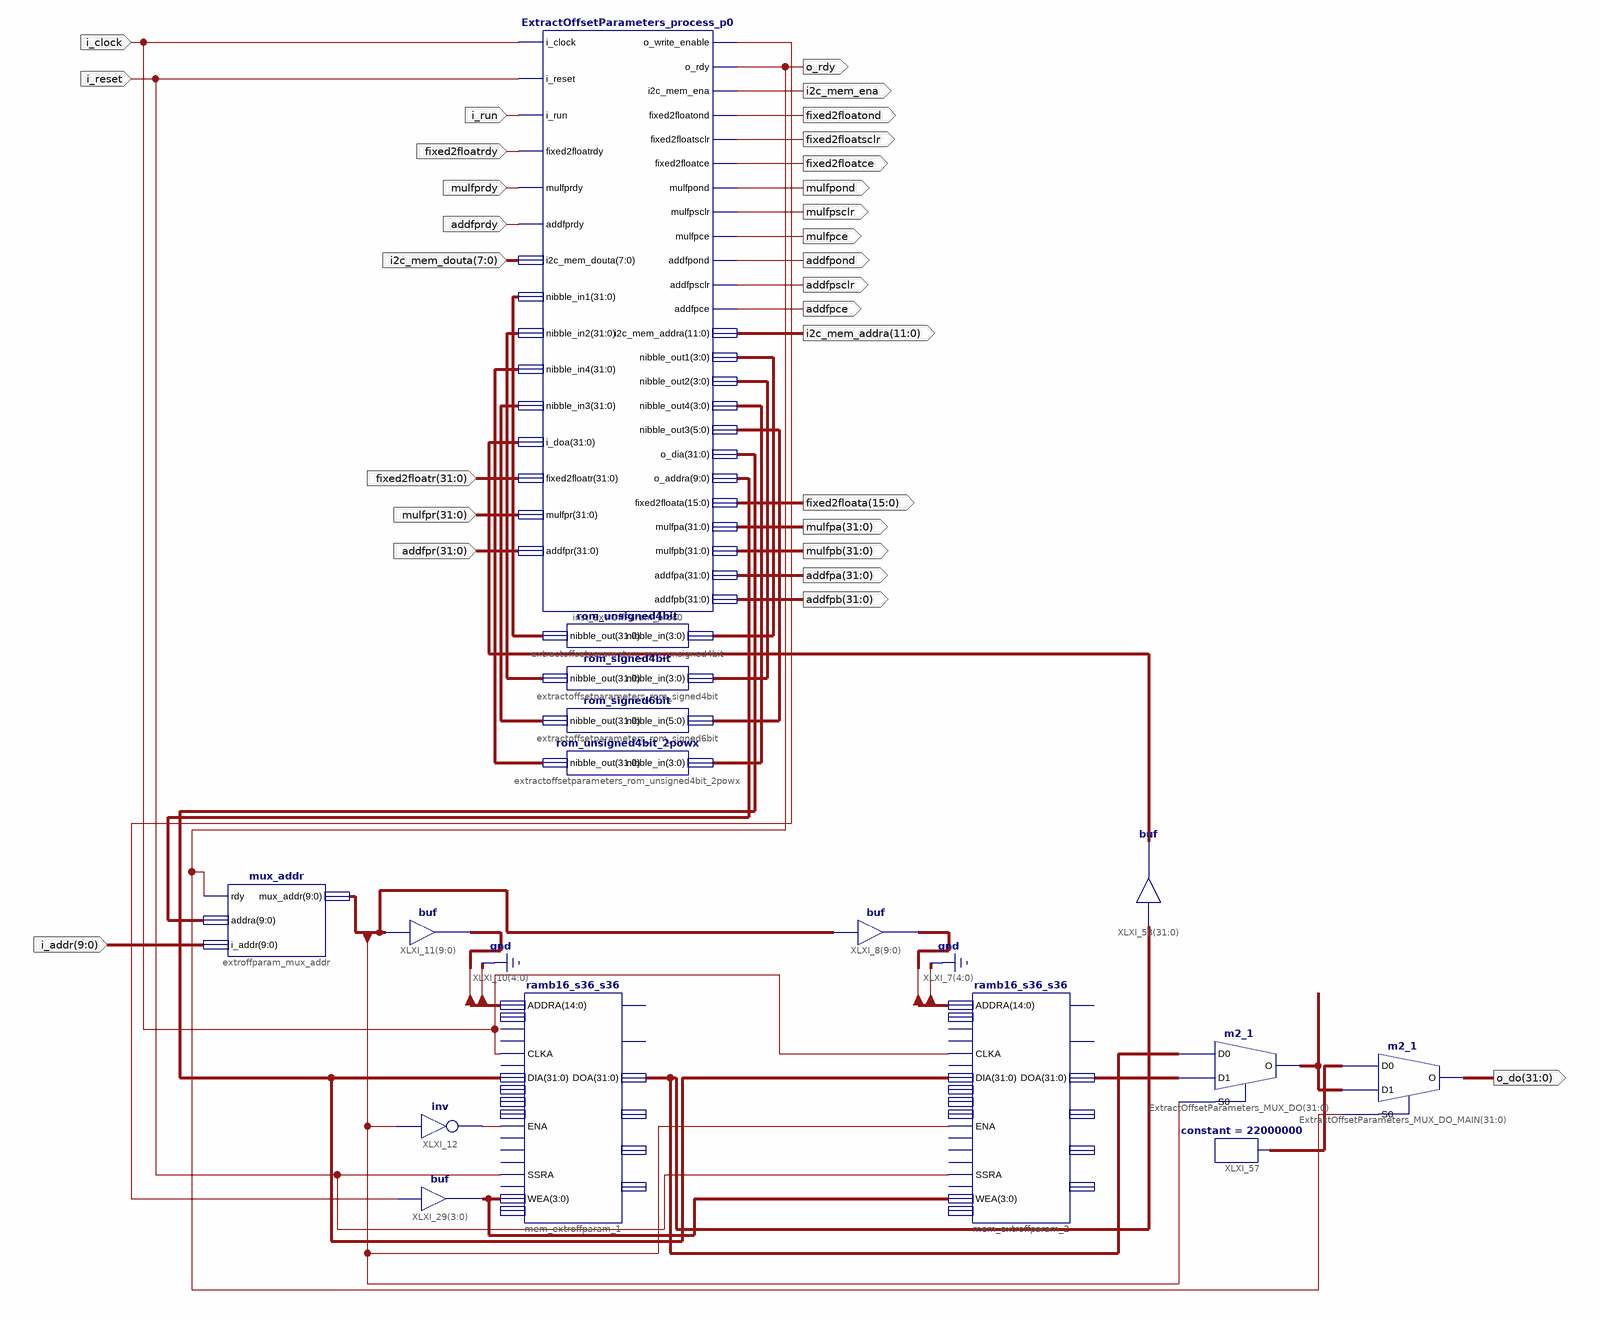
[diagram p0: schematic sheet 1]
// Xilinx ISE schematic ExtractOffsetParameters.sch (virtex4) as structural Verilog: 16 symbols, 29 ports
module ExtractOffsetParameters (
  input  i_clock,
  input  i_reset,
  input  [9:0] i_addr,
  input  i_run,
  input  fixed2floatrdy,
  input  mulfprdy,
  input  addfprdy,
  input  [7:0] i2c_mem_douta,
  input  [31:0] fixed2floatr,
  input  [31:0] mulfpr,
  input  [31:0] addfpr,
  output o_rdy,
  output i2c_mem_ena,
  output fixed2floatond,
  output fixed2floatsclr,
  output fixed2floatce,
  output mulfpond,
  output mulfpsclr,
  output mulfpce,
  output addfpond,
  output addfpsclr,
  output addfpce,
  output [11:0] i2c_mem_addra,
  output [15:0] fixed2floata,
  output [31:0] mulfpa,
  output [31:0] mulfpb,
  output [31:0] addfpa,
  output [31:0] addfpb,
  output [31:0] o_do
);

  wire write_enable, XLXN_59;
  wire [3:0] nibble_out1, nibble_out2, nibble_out4, XLXN_139;
  wire [5:0] nibble_out3;
  wire [9:0] mux_addr1, o_addra;
  wire [14:5] addra1, addra2;
  wire [31:0] doa1, doa2, nibble_in1, nibble_in2, nibble_in3, nibble_in4, o_dia, XLXN_169, XLXN_179, XLXN_180;

  assign addra2 = mux_addr1;  // buf XLXI_8[9..0], 10 bits wide
  assign addra1 = mux_addr1;  // buf XLXI_11[9..0], 10 bits wide
  not XLXI_12 (XLXN_59, mux_addr1[9]);
  ramb16_s36_s36 #(.WRITE_WIDTH_B(36), .WRITE_WIDTH_A(36), .WRITE_MODE_B("READ_FIRST"), .WRITE_MODE_A("READ_FIRST"), .READ_WIDTH_B(36), .READ_WIDTH_A(36)) mem_extroffparam_2 (
    .ADDRA({addra2, {5{1'b0}}}), .CLKA(i_clock), .DIA(o_dia), .ENA(mux_addr1[9]), .SSRA(i_reset),
    .WEA(XLXN_139), .DOA(doa2));  // open: ADDRB, CASCADEINA, CASCADEINB, CLKB, DIB, DIPA, DIPB, REGCEA, REGCEB, ENB, SSRB, WEB, CASCADEOUTA, CASCADEOUTB, DOB, DOPA, DOPB
  ramb16_s36_s36 #(.WRITE_WIDTH_B(36), .WRITE_WIDTH_A(36), .WRITE_MODE_B("READ_FIRST"), .WRITE_MODE_A("READ_FIRST"), .READ_WIDTH_B(36), .READ_WIDTH_A(36)) mem_extroffparam_1 (
    .ADDRA({addra1, {5{1'b0}}}), .CLKA(i_clock), .DIA(o_dia), .ENA(XLXN_59), .SSRA(i_reset), .WEA(XLXN_139),
    .DOA(doa1));  // open: ADDRB, CASCADEINA, CASCADEINB, CLKB, DIB, DIPA, DIPB, REGCEA, REGCEB, ENB, SSRB, WEB, CASCADEOUTA, CASCADEOUTB, DOB, DOPA, DOPB
  m2_1 ExtractOffsetParameters_MUX_DO[31:0] (.D0(doa1), .D1(doa2), .S0(mux_addr1[9]), .O(XLXN_180));
  assign XLXN_139 = {4{write_enable}};  // buf XLXI_29[3..0], 4 bits wide
  ExtractOffsetParameters_process_p0 inst_ExtrOffParam_proc0 (
    .i_clock(i_clock), .i_reset(i_reset), .i_run(i_run), .fixed2floatrdy(fixed2floatrdy),
    .mulfprdy(mulfprdy), .addfprdy(addfprdy), .i2c_mem_douta(i2c_mem_douta), .nibble_in1(nibble_in1),
    .nibble_in2(nibble_in2), .nibble_in4(nibble_in4), .nibble_in3(nibble_in3), .i_doa(XLXN_169),
    .fixed2floatr(fixed2floatr), .mulfpr(mulfpr), .addfpr(addfpr), .o_write_enable(write_enable),
    .o_rdy(o_rdy), .i2c_mem_ena(i2c_mem_ena), .fixed2floatond(fixed2floatond),
    .fixed2floatsclr(fixed2floatsclr), .fixed2floatce(fixed2floatce), .mulfpond(mulfpond),
    .mulfpsclr(mulfpsclr), .mulfpce(mulfpce), .addfpond(addfpond), .addfpsclr(addfpsclr), .addfpce(addfpce),
    .i2c_mem_addra(i2c_mem_addra), .nibble_out1(nibble_out1), .nibble_out2(nibble_out2),
    .nibble_out4(nibble_out4), .nibble_out3(nibble_out3), .o_dia(o_dia), .o_addra(o_addra),
    .fixed2floata(fixed2floata), .mulfpa(mulfpa), .mulfpb(mulfpb), .addfpa(addfpa), .addfpb(addfpb));
  rom_unsigned4bit extractoffsetparameters_rom_unsigned4bit (.nibble_in(nibble_out1), .nibble_out(nibble_in1));
  rom_signed4bit extractoffsetparameters_rom_signed4bit (.nibble_in(nibble_out2), .nibble_out(nibble_in2));
  rom_signed6bit extractoffsetparameters_rom_signed6bit (.nibble_in(nibble_out3), .nibble_out(nibble_in3));
  rom_unsigned4bit_2powx extractoffsetparameters_rom_unsigned4bit_2powx (
    .nibble_in(nibble_out4), .nibble_out(nibble_in4));
  mux_addr extroffparam_mux_addr (.rdy(o_rdy), .addra(o_addra), .i_addr(i_addr), .mux_addr(mux_addr1));
  m2_1 ExtractOffsetParameters_MUX_DO_MAIN[31:0] (.D0(XLXN_179), .D1(XLXN_180), .S0(o_rdy), .O(o_do));
  constant #(.CValue("22000000")) XLXI_57 (.O(XLXN_179));
  assign XLXN_169 = doa1;  // buf XLXI_58[31..0], 32 bits wide
endmodule
